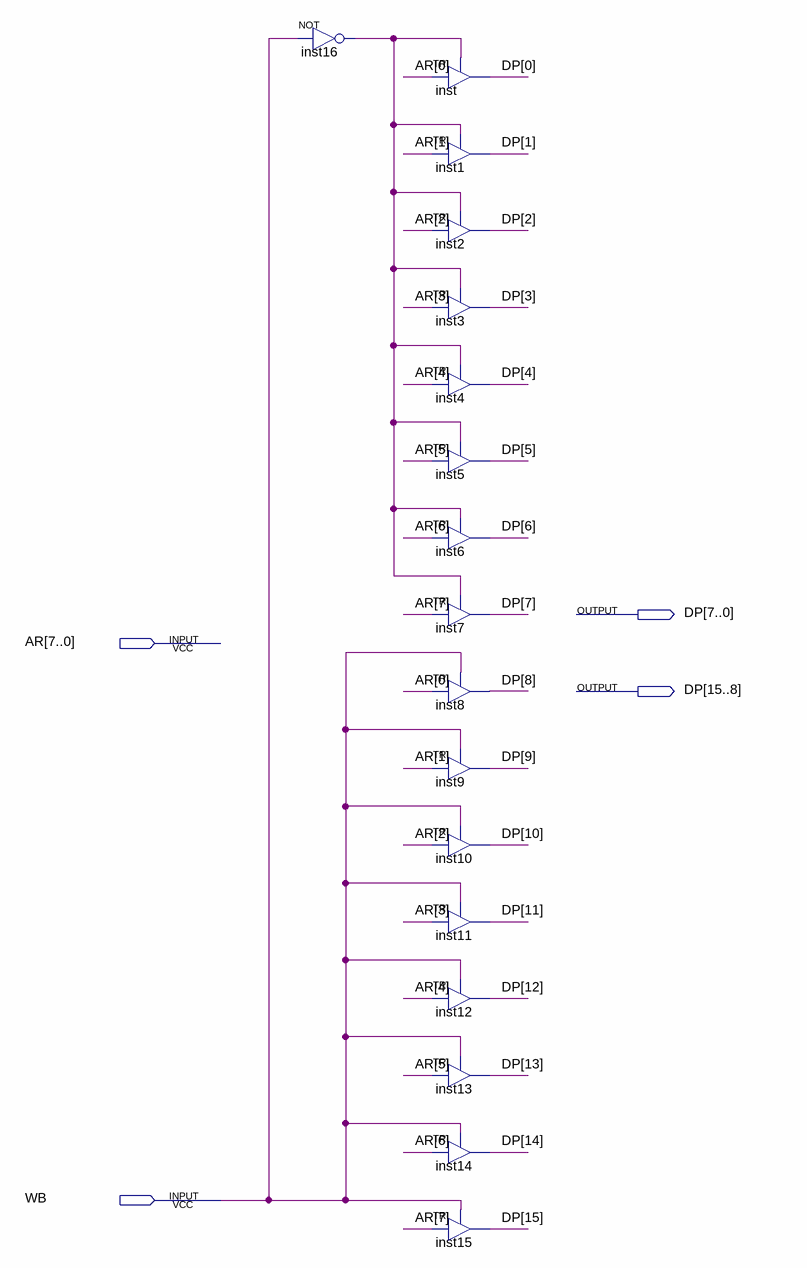
[diagram p0: schematic sheet]
// Quartus schematic Demultiplexer.bdf as structural Verilog: 17 symbols, 4 pins
module Demultiplexer (
  input  [7:0] AR,
  input  WB,
  output [15:0] DP
);

  wire inst16_out;

  not inst16 (inst16_out, WB);
  TRI inst (.IN(AR[0]), .OE(inst16_out), .OUT(DP[0]));
  TRI inst1 (.IN(AR[1]), .OE(inst16_out), .OUT(DP[1]));
  TRI inst2 (.IN(AR[2]), .OE(inst16_out), .OUT(DP[2]));
  TRI inst3 (.IN(AR[3]), .OE(inst16_out), .OUT(DP[3]));
  TRI inst4 (.IN(AR[4]), .OE(inst16_out), .OUT(DP[4]));
  TRI inst5 (.IN(AR[5]), .OE(inst16_out), .OUT(DP[5]));
  TRI inst6 (.IN(AR[6]), .OE(inst16_out), .OUT(DP[6]));
  TRI inst7 (.IN(AR[7]), .OE(inst16_out), .OUT(DP[7]));
  TRI inst8 (.IN(AR[0]), .OE(WB), .OUT(DP[8]));
  TRI inst9 (.IN(AR[1]), .OE(WB), .OUT(DP[9]));
  TRI inst10 (.IN(AR[2]), .OE(WB), .OUT(DP[10]));
  TRI inst11 (.IN(AR[3]), .OE(WB), .OUT(DP[11]));
  TRI inst12 (.IN(AR[4]), .OE(WB), .OUT(DP[12]));
  TRI inst13 (.IN(AR[5]), .OE(WB), .OUT(DP[13]));
  TRI inst14 (.IN(AR[6]), .OE(WB), .OUT(DP[14]));
  TRI inst15 (.IN(AR[7]), .OE(WB), .OUT(DP[15]));
endmodule
